# Altium project PCB_Project_1.PrjPcb
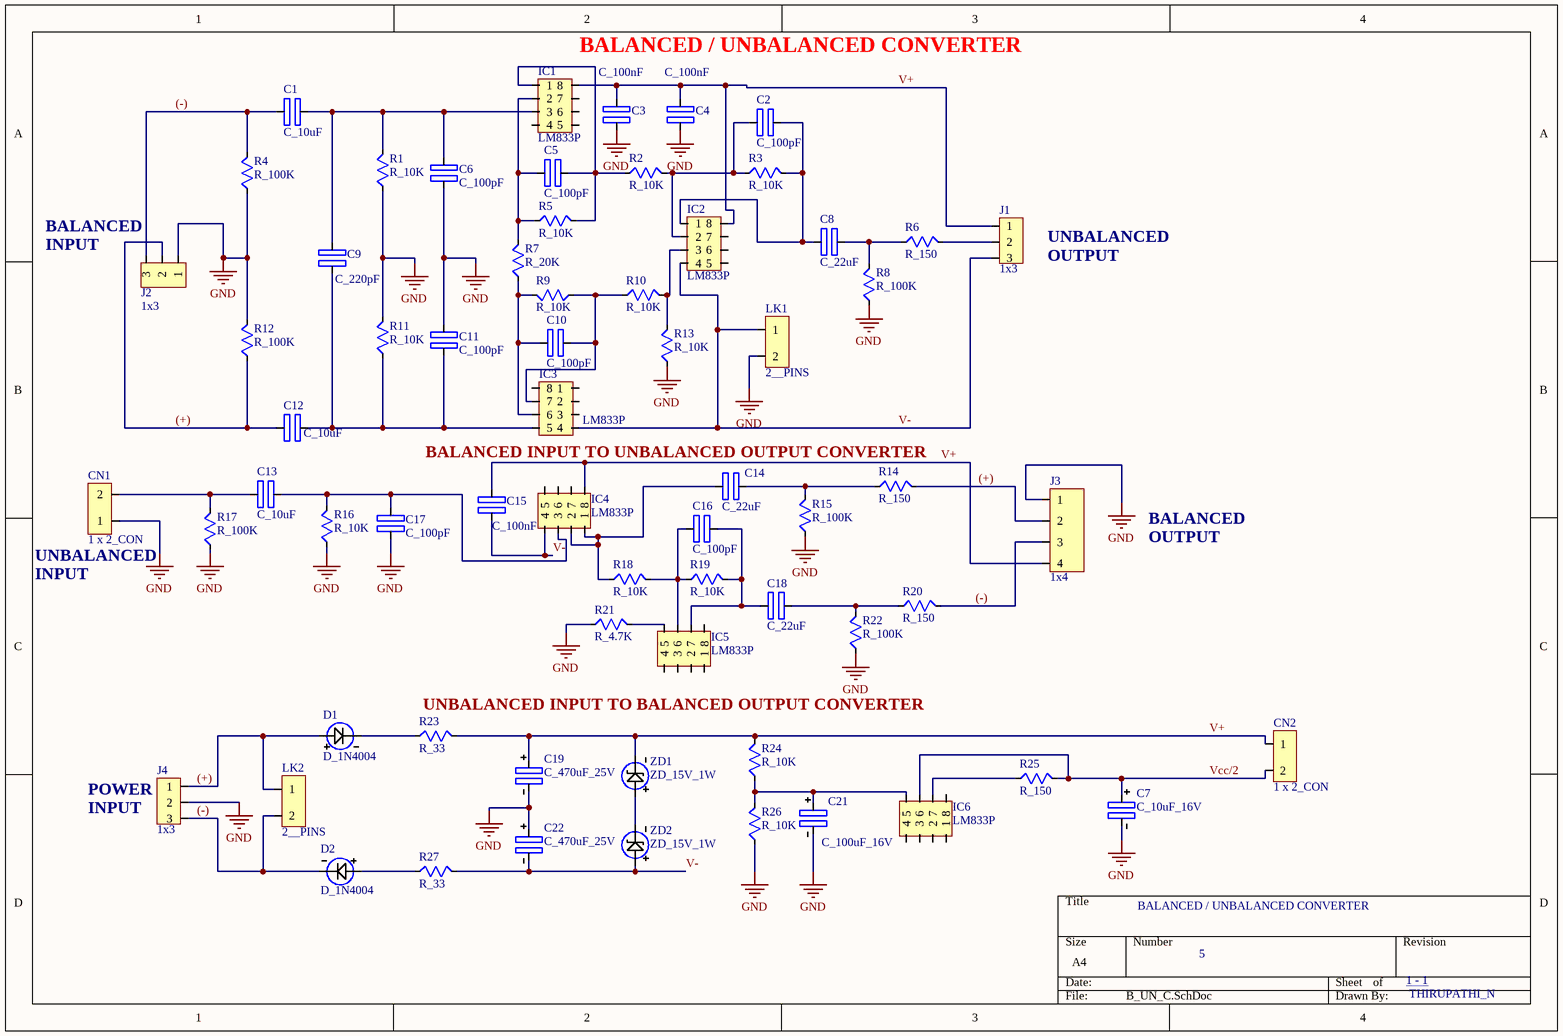
[diagram p0: B_UN_C.SchDoc]
1 sheet, 66 parts. Net scope: global (net labels, ports and power ports of the same name join across sheets).
Board file: B_UN_C.PcbDoc

## Sheet B_UN_C.SchDoc
size A4; SheetNumber: 1; SheetTotal: 1

### Parts
C1  C_10uF  [C_10uF]
C2  C_100pF  [C_100pF]
C3  C_100nF  [C_100nF]
C4  C_100nF  [C_100nF]
C5  C_100pF  [C_100pF]
C6  C_100pF  [C_100pF]
C7  C_10uF_16V  [C_10uF_16V]
C8  C_22uF  [C_22uF]
C9  C_220pF  [C_220pF]
C10  C_100pF  [C_100pF]
C11  C_100pF  [C_100pF]
C12  C_10uF  [C_10uF]
C13  C_10uF  [C_10uF]
C14  C_22uF  [C_22uF]
C15  C_100nF  [C_100nF]
C16  C_100pF  [C_100pF]
C17  C_100pF  [C_100pF]
C18  C_22uF  [C_22uF]
C19  C_470uF_25V  [C_25V_470uF]
C21  C_100uF_16V  [C_100uF_16V]
C22  C_470uF_25V  [C_25V_470uF]
CN1  1 x 2_CON  [1*2_CONNECTOR]
CN2  1 x 2_CON  [1*2_CONNECTOR]
D1  D_1N4004  [D_IN4004]
D2  D_1N4004  [D_IN4004]
IC1  LM833P  [IC_833]
IC2  LM833P  [IC_833]
IC3  LM833P  [IC_833]
IC4  LM833P  [IC_833]
IC5  LM833P  [IC_833]
IC6  LM833P  [IC_833]
J1  1x3  [1*3_CONNECTOR]
J2  1x3  [1*3_CONNECTOR]
J3  1x4  [1*4_CONNECTOR]
J4  1x3  [1*3_CONNECTOR]
LK1  2__PINS  [2_PIN]
LK2  2__PINS  [2_PIN]
R1  R_10K  [CF_RESISTOR_FP]
R2  R_10K  [CF_RESISTOR_FP]
R3  R_10K  [CF_RESISTOR_FP]
R4  R_100K  [CF_RESISTOR_FP]
R5  R_10K  [CF_RESISTOR_FP]
R6  R_150  [CF_RESISTOR_FP]
R7  R_20K  [CF_RESISTOR_FP]
R8  R_100K  [CF_RESISTOR_FP]
R9  R_10K  [CF_RESISTOR_FP]
R10  R_10K  [CF_RESISTOR_FP]
R11  R_10K  [CF_RESISTOR_FP]
R12  R_100K  [CF_RESISTOR_FP]
R13  R_10K  [CF_RESISTOR_FP]
R14  R_150  [CF_RESISTOR_FP]
R15  R_100K  [CF_RESISTOR_FP]
R16  R_10K  [CF_RESISTOR_FP]
R17  R_100K  [CF_RESISTOR_FP]
R18  R_10K  [CF_RESISTOR_FP]
R19  R_10K  [CF_RESISTOR_FP]
R20  R_150  [CF_RESISTOR_FP]
R21  R_4.7K  [R_4.7K]
R22  R_100K  [CF_RESISTOR_FP]
R23  R_33  [CF_RESISTOR_FP]
R24  R_10K  [CF_RESISTOR_FP]
R25  R_150  [CF_RESISTOR_FP]
R26  R_10K  [CF_RESISTOR_FP]
R27  R_33  [CF_RESISTOR_FP]
ZD1  ZD_15V_1W  [ZR_15V_1W]
ZD2  ZD_15V_1W  [ZR_15V_1W]

### Nets
GND: C3.0 C4.0 C6.0 C7.1 C11.1 C17.0 C19.1 C21.1 C22.0 CN1.1 J2.1 J3.1 J4.2 LK1.2 R1.0 R4.0 R8.0 R11.1 R12.1 R13.0 R15.0 R16.0 R17.0 R21.0 R22.0 R26.0
(+): C12.0 D1.2 J2.2 J3.2 J4.1 LK2.1 R12.0 R14.1
(-): C1.0 D2.1 J2.3 J3.3 J4.3 LK2.2 R4.1 R20.1
V+: C3.1 C4.1 C15.1 C19.0 CN2.1 IC1.8 IC2.8 IC4.8 J1.1 J3.4 R23.1 R24.1 ZD1.1
V-: C15.0 C22.1 IC2.4 IC3.4 IC4.4 J1.3 LK1.1 R27.1 ZD2.2
Vcc/2: C7.0 CN2.2 IC6.6 R25.1
NetC1_1: C1.1 C6.1 C9.1 IC1.3 R1.1
NetC2_0: C2.0 IC2.2 R2.1 R3.0
NetC2_1: C2.1 C8.0 IC2.1 R3.1
NetC5_0: C5.0 IC1.2 R5.0 R7.1
NetC5_1: C5.1 IC1.1 R2.0 R5.1
NetC8_1: C8.1 R6.0 R8.1
NetC9_0: C9.0 C11.0 C12.1 IC3.5 R11.0
NetC10_0: C10.0 IC3.7 R9.0 R10.0
NetC10_1: C10.1 IC3.6 R7.0 R9.1
NetC13_0: C13.0 CN1.2 R17.1
NetC13_1: C13.1 C17.1 IC4.3 R16.1
NetC14_0: C14.0 IC4.1 IC4.2 R18.0
NetC14_1: C14.1 R14.0 R15.1
NetC16_0: C16.0 IC5.6 R18.1 R19.0
NetC16_1: C16.1 C18.0 IC5.7 R19.1
NetC18_1: C18.1 R20.0 R22.1
NetC21_0: C21.0 IC6.5 R24.0 R26.1
NetD1_1: D1.1 R23.0
NetD2_2: D2.2 R27.0
NetIC2_3: IC2.3 R10.1 R13.1
NetIC5_5: IC5.5 R21.1
NetIC6_7: IC6.7 R25.0
NetJ1_2: J1.2 R6.1
NetZD1_2: ZD1.2 ZD2.1

Not connected (* = marked no-connect by the designer): IC1 4 5 6 7; IC2 5 6 7; IC3 1 2 3 8; IC4 5 6 7; IC5 1 2 3 4 8; IC6 1 2 3 4 8

### Notes on the sheet
- (near IC1) BALANCED / UNBALANCED CONVERTER
- (near J2) BALANCED
- (near J1) UNBALANCED
- INPUT
- (near J1) OUTPUT
- BALANCED INPUT TO UNBALANCED OUTPUT CONVERTER
- (near CN1) UNBALANCED
- BALANCED
- OUTPUT
- UNBALANCED INPUT TO BALANCED OUTPUT CONVERTER
- (near J4) POWER
- (near J4) INPUT
- BALANCED / UNBALANCED CONVERTER
- 5
- 1 - 1
- THIRUPATHI_N

### Library data of the parts
C1 C12 C13 = C_10uF: CAP ALUM 10UF 20% 400V RADIAL; Manufacturer: Nichicon; Manufacturer Part Number: UCA2G100MPD1TD; Life (Hours): 10000Hour; Ripple Current: 280mA; Lead Diameter: 0.6mm; Supplier 1: Digi-Key; RoHS: Yes; Category: Aluminum Electrolytic Capacitors; Stock 1: 4242; Pricing 1: 1=0.81000, 10=0.60000, 50=0.48020, 100=0.41150 (USD); Mount: Through Hole; Case/Package: Radial; Min Operating Temperature: -25°C; Max Operating Temperature: 105°C; Capacitance: 10uF; Voltage Rating: 400V; Tolerance: 20%; Packaging: Tape and Reel; Package Quantity: 500; Termination: Radial; Voltage Rating (DC): 400V; Series: CA; Lead Pitch: 0.197inch; Height - Seated (Max): 0.846inch; Lead Free: Lead Free; RoHS Compliant: Yes; ComponentLink1URL: https://datasheet.ciiva.com/6299/e-ca-6299384.pdf?src-supplier=Digi-Key; ComponentLink1Description: https://datasheet.ciiva.com/6299/e-ca-6299384.pdf?src-supplier=Digi-Key; Supplier Part Number 1: 493-4771-1-ND
C2 C5 C6 C10 C11 C16 C17 = C_100pF: CAPACITOR CERAMIC 100PF 3000V C0G 5%, RAD; Manufacturer: KEMET; Manufacturer Part Number: C330C101JHG5TA; Voltage Rating: 3kV; Temperature Coefficient: 30ppm/°C; Dissipation Factor: 0.1%; Lead/Base Style: Straight; Lead Diameter: 0.51mm; Pitch: 5.08mm; Lead Length: 7mm; Supplier 1: Digi-Key; RoHS: Yes; Category: Ceramic Capacitors; Stock 1: 2092; Pricing 1: 1=2.77000, 10=2.23700, 50=1.95200, 100=1.70800, 500=1.30134, 1000=1.13868, 2500=1.09801, 5000=1.05734 (USD); Mount: Through Hole; Case/Package: Radial; Number of Pins: 2; Min Operating Temperature: -55°C; Max Operating Temperature: 125°C; Capacitance: 100pF; Tolerance: 5%; Packaging: Bulk; Voltage Rating (DC): 3kV; Package Quantity: 250; Dielectric: C0G; Termination: Radial; Length: 7.62mm; Width: 7.62mm; Height: 3.81mm; Lead Pitch: 5.08mm; Height - Seated (Max): 0.36inch; Depth: 6.35mm; Radiation Hardening: No; REACH SVHC: No SVHC; Lead Free: Lead Free; RoHS Compliant: Yes; ComponentLink1URL: https://datasheet.ciiva.com/203/f3101-goldmax-203490.pdf?src-supplier=Digi-Key; ComponentLink1Description: https://datasheet.ciiva.com/203/f3101-goldmax-203490.pdf?src-supplier=Digi-Key; ComponentLink2URL: https://datasheet.ciiva.com/28645/706880-28645882.pdf?src-supplier=Element14; ComponentLink2Description: https://datasheet.ciiva.com/28645/706880-28645882.pdf?src-supplier=Element14; ComponentLink3URL: https://datasheet.ciiva.com/41659/f3101-goldmax-41659614.pdf?src-supplier=Farnell; ComponentLink3Description: https://datasheet.ciiva.com/41659/f3101-goldmax-41659614.pdf?src-supplier=Farnell; Supplier Part Number 1: 399-5096-ND
C3 C4 C15 = C_100nF: NICHICON   UVR2A0R1MDD1TD   ALUMINUM ELECTROLYTIC CAPACITOR, 0.1UF, 100V, 20%, RADIAL; Dielectric Material: Aluminium; Capacitance: 100nF; Ripple Current: 2.1mA; Life (Hours): 2000Hour; Supplier 1: Digi-Key; Manufacturer: Nichicon; Manufacturer Part Number: UVR2A0R1MDD1TD; RoHS: Yes; Category: Aluminum Electrolytic Capacitors; Stock 1: 5234; Pricing 1: 1=0.29000, 10=0.20000, 50=0.12000, 100=0.10140, 500=0.06936, 1000=0.06136 (USD); Mount: Through Hole; Case/Package: Radial; Number of Pins: 2; Min Operating Temperature: -40°C; Max Operating Temperature: 85°C; Package Quantity: 1; Packaging: Tape and Reel; Tolerance: 20%; Voltage Rating: 100V; Termination: Radial; Voltage Rating (DC): 100V; Series: VR; Diameter: 5mm; Height: 11mm; Lead Pitch: 0.079inch; Height - Seated (Max): 0.492inch; REACH SVHC: No SVHC; RoHS Compliant: Yes; ComponentLink1URL: https://datasheet.ciiva.com/7907/e-vr-7907512.pdf?src-supplier=Element14; ComponentLink1Description: https://datasheet.ciiva.com/7907/e-vr-7907512.pdf?src-supplier=Element14; ComponentLink2URL: https://datasheet.ciiva.com/29544/e-vr-29544649.pdf?src-supplier=Digi-Key; ComponentLink2Description: https://datasheet.ciiva.com/29544/e-vr-29544649.pdf?src-supplier=Digi-Key; Supplier Part Number 1: 493-12812-1-ND
C7 = C_10uF_16V: CAPACITOR ALUM ELECT, 10UF, 16V, 20%, RADIAL; Manufacturer: Nichicon; Manufacturer Part Number: UST1C100MDD1TE; Ripple Current: 29mA; Leakage Current: 3uA; Life (Hours): 1000Hour; Dissipation Factor: 0.18%; Supplier 1: Digi-Key; RoHS: Yes; Category: Aluminum Electrolytic Capacitors; Stock 1: 4188; Pricing 1: 1=0.25000, 10=0.17300, 50=0.11540, 100=0.09810, 500=0.06928, 1000=0.06062 (USD); Mount: Through Hole; Case/Package: Radial; Min Operating Temperature: -55°C; Max Operating Temperature: 105°C; Package Quantity: 1; Capacitance: 10uF; Voltage Rating: 16V; Tolerance: 20%; Packaging: Tape and Reel; Termination: Radial; Voltage Rating (DC): 16V; Series: PML CAP, ST; Diameter: 4mm; Length: 7mm; Height: 7mm; Lead Pitch: 0.059inch; Height - Seated (Max): 0.315inch; RoHS Compliant: Yes; ComponentLink1URL: https://datasheet.ciiva.com/6314/e-st-6314645.pdf?src-supplier=Digi-Key; ComponentLink1Description: https://datasheet.ciiva.com/6314/e-st-6314645.pdf?src-supplier=Digi-Key; Supplier Part Number 1: 493-14735-1-ND
C8 C14 C18 = C_22uF: Cap Aluminum Lytic 22uF 50V 20% (5 X 11mm) Radial 2.5mm 95mA 2000h 85C Ammo Pack; Manufacturer: Nichicon; Manufacturer Part Number: UVR1H220MDD1TD; Dielectric Material: Aluminium; Leakage Current: 33uA; Life (Hours): 2000Hour; Dissipation Factor: 0.12%; Lead Diameter: 0.5mm; Supplier 1: Digi-Key; RoHS: Yes; Category: Aluminum Electrolytic Capacitors; Stock 1: 2541; Pricing 1: 1=0.29000, 10=0.20000, 50=0.12000, 100=0.10140, 500=0.06936, 1000=0.06136 (USD); Mount: Through Hole,PCB; Case/Package: Radial; Contact Plating: Tin,Matte; Min Operating Temperature: -40°C; Max Operating Temperature: 85°C; Capacitance: 22uF; Voltage Rating: 50V; Tolerance: 20%; Ripple Current: 95mA; Packaging: Tape and Reel; Package Quantity: 1; Voltage Rating (DC): 50V; Termination: Radial; Voltage: 50V; Features: General Purpose; Series: VR; Construction: RADIAL; Diameter: 5mm; Length: 11mm; Height: 11mm; Height - Seated (Max): 0.492inch; Lead Pitch: 2mm; Radiation Hardening: No; REACH SVHC: No SVHC; Lead Free: Lead Free; RoHS Compliant: Yes; ComponentLink1URL: https://datasheet.ciiva.com/16512/e-vr-16512886.pdf?src-supplier=Future+Electronics; ComponentLink1Description: https://datasheet.ciiva.com/16512/e-vr-16512886.pdf?src-supplier=Future+Electronics; ComponentLink2URL: https://datasheet.ciiva.com/5330/e-vr-6088-5330936.pdf?src-supplier=Mouser; ComponentLink2Description: https://datasheet.ciiva.com/5330/e-vr-6088-5330936.pdf?src-supplier=Mouser; ComponentLink3URL: https://datasheet.ciiva.com/7781/e-vr-7781742.pdf?src-supplier=Element14; ComponentLink3Description: https://datasheet.ciiva.com/7781/e-vr-7781742.pdf?src-supplier=Element14; ComponentLink4URL: https://datasheet.ciiva.com/6298/e-vr-6298255.pdf?src-supplier=Digi-Key; ComponentLink4Description: https://datasheet.ciiva.com/6298/e-vr-6298255.pdf?src-supplier=Digi-Key; Supplier Part Number 1: 493-6098-1-ND
C9 = C_220pF: VISHAY         F221K25Y5RN6UK5R             Ceramic Disc & Plate Capacitor, 220 pF, 1 kV, F Series,  10%, Radial Leaded, Y5R; Manufacturer: Vishay BCcomponents; Capacitance: 220pF; Voltage Rating: 1kV; Insulation Resistance: 10GR; Lead/Base Style: Kinked; Lead Diameter: 0.6mm; Supplier 1: Digi-Key; Manufacturer Part Number: F221K25Y5RN6UK5R; RoHS: Yes; Category: Ceramic Capacitors; Stock 1: 17892; Pricing 1: 1=0.26000, 10=0.18000, 50=0.11960, 100=0.10170, 500=0.07180, 1000=0.06283 (USD); Mount: Through Hole; Case/Package: Radial; Dielectric Material: Ceramic; Min Operating Temperature: -30°C; Max Operating Temperature: 125°C; Tolerance: 10%; Dielectric: Y5R; Termination: Radial; Package Quantity: 2000; Packaging: Tape and Reel; Resistor Type: Ceramic; Voltage: 1kV; Series: F; Construction: RADIAL; Length: 6.5mm; Lead Pitch: 5mm; Depth: 4.5mm; Radiation Hardening: No; REACH SVHC: Unknown; RoHS Compliant: Yes; ComponentLink1URL: https://datasheet.ciiva.com/11789/0900766b80d81bfa-11789705.pdf?src-supplier=RSComponents; ComponentLink1Description: https://datasheet.ciiva.com/11789/0900766b80d81bfa-11789705.pdf?src-supplier=RSComponents; ComponentLink2URL: https://datasheet.ciiva.com/15165/getdatasheetpartid-691058-15165003.pdf?src-supplier=Verical; ComponentLink2Description: https://datasheet.ciiva.com/15165/getdatasheetpartid-691058-15165003.pdf?src-supplier=Verical; ComponentLink3URL: https://datasheet.ciiva.com/182/hvldf02-182150.pdf?src-supplier=Digi-Key; ComponentLink3Description: https://datasheet.ciiva.com/182/hvldf02-182150.pdf?src-supplier=Digi-Key; ComponentLink4URL: https://datasheet.ciiva.com/11461/hvldf02-11461596.pdf?src-supplier=Avnet; ComponentLink4Description: https://datasheet.ciiva.com/11461/hvldf02-11461596.pdf?src-supplier=Avnet; ComponentLink5URL: https://datasheet.ciiva.com/16695/hvldf02-16695021.pdf?src-supplier=Avnet+Europe; ComponentLink5Description: https://datasheet.ciiva.com/16695/hvldf02-16695021.pdf?src-supplier=Avnet+Europe; ComponentLink6URL: https://datasheet.ciiva.com/7974/1522849-7974607.pdf?src-supplier=Element14; ComponentLink6Description: https://datasheet.ciiva.com/7974/1522849-7974607.pdf?src-supplier=Element14; Supplier Part Number 1: BC5218CT-ND
C19 C22 = C_470uF_25V: NICHICON         UHE1E471MPD6TD            ALUMINUM ELECTROLYTIC CAPACITOR, 470UF, 25V, 20%, RADIAL; Dielectric Material: Aluminium; Ripple Current: 1.21A; ESR (Equivalent Series Resistance): 240mR; Polarity: Polar; Impedance: 60mR; Life (Hours): 7000Hour; Dissipation Factor: 0.14%; Lead Diameter: 0.6mm; Supplier 1: Digi-Key; Manufacturer: Nichicon; Manufacturer Part Number: UHE1E471MPD6TD; RoHS: Yes; Category: Aluminum Electrolytic Capacitors; Stock 1: 3720; Pricing 1: 1=0.70000, 10=0.49200, 50=0.37180, 100=0.32390 (USD); Mount: Through Hole; Case/Package: Radial; Number of Pins: 2; Min Operating Temperature: -40°C; Max Operating Temperature: 105°C; Capacitance: 470uF; Tolerance: 20%; Packaging: Tape and Reel; Package Quantity: 500; Voltage Rating: 25V; Voltage Rating (DC): 25V; Termination: Radial; Series: HE; Diameter: 10mm; Length: 16mm; Height: 16mm; Lead Pitch: 5mm; Height - Seated (Max): 0.688inch; Radiation Hardening: No; REACH SVHC: No SVHC; Lead Free: Lead Free; RoHS Compliant: Yes; ComponentLink1URL: https://datasheet.ciiva.com/17520/e-he-17520934.pdf?src-supplier=Avnet+Europe; ComponentLink1Description: https://datasheet.ciiva.com/17520/e-he-17520934.pdf?src-supplier=Avnet+Europe; ComponentLink2URL: https://datasheet.ciiva.com/7851/e-he-7851630.pdf?src-supplier=Element14; ComponentLink2Description: https://datasheet.ciiva.com/7851/e-he-7851630.pdf?src-supplier=Element14; Supplier Part Number 1: 493-15240-1-ND
C21 = C_100uF_16V: Cap Aluminum Lytic 100uF 16V 20% (6.3 X 7mm) Radial 2.5mm 110mA 1000h 105°C Ammo; Manufacturer: KEMET; Manufacturer Part Number: ESS107M016AE2EA; Supplier 1: Digi-Key; Category: Aluminum Electrolytic Capacitors; Stock 1: 4956; Pricing 1: 1=0.22000, 10=0.14800, 50=0.08920, 100=0.07520, 500=0.05148, 1000=0.04554 (USD); Case/Package: Aluminum; Max Operating Temperature: 105°C; Capacitance: 100uF; Package Quantity: 2000; Voltage Rating: 16V; Voltage Rating (DC): 16V; Tolerance: 20%; Packaging: Ammo Pack; Termination: Radial; Series: ESS; Length: 7mm; Lead Pitch: 5mm; RoHS Compliant: Yes; ComponentLink1URL: http://www.mouser.com/ds/2/212/KEM_A4057_ESS-1077971.pdf?src-supplier=Mouser; ComponentLink1Description: http://www.mouser.com/ds/2/212/KEM_A4057_ESS-1077971.pdf?src-supplier=Mouser; ComponentLink2URL: http://datasheet.octopart.com/ESS107M016AE2EA-KEMET-datasheet-141704041.pdf?src-supplier=Farnell; ComponentLink2Description: http://datasheet.octopart.com/ESS107M016AE2EA-KEMET-datasheet-141704041.pdf?src-supplier=Farnell; ComponentLink3URL: http://datasheet.octopart.com/ESS107M016AE2EA-KEMET-datasheet-102161911.pdf?src-supplier=Newark; ComponentLink3Description: http://datasheet.octopart.com/ESS107M016AE2EA-KEMET-datasheet-102161911.pdf?src-supplier=Newark; Supplier Part Number 1: 399-18280-1-ND
CN1 CN2 = 1 x 2_CON: TERM BLK 2POS SIDE ENTRY 5MM PCB; Manufacturer: Wurth Electronics; Manufacturer Part Number: 691137710002; Plating: Copper Alloy; Number of Levels: 1; Number of Positions Per Level: 2; Current: 16A; Voltage: 300V; Wire Gauge (Max): 30AWG; Wire Gauge (Min): 12AWG; Supplier 1: Digi-Key; RoHS: No; Category: Terminal Blocks; Stock 1: 8076; Pricing 1: 1=0.38000, 10=0.34000, 50=0.30000, 100=0.27000, 500=0.26000 (USD); Mount: Through Hole; Color: Green; Housing Material: PC; Min Operating Temperature: -30°C; Max Operating Temperature: 120°C; Packaging: Bulk; Termination: Screw; ComponentLink1URL: https://katalog.we-online.de/em/datasheet/691137710002.pdf?src-supplier=Digi-Key; ComponentLink1Description: https://katalog.we-online.de/em/datasheet/691137710002.pdf?src-supplier=Digi-Key; Supplier Part Number 1: 732-10955-ND
D1 D2 = D_1N4004: DIODES INC. - 1N4004-T - Standard Recovery Diode, 400 V, 1 A, Single, 1 V, 30 A; Max Surge Current: 30A; Max Reverse Current: 5uA; Forward Current: 1A; Forward Voltage: 1V; Reverse Voltage (DC): 400V; Recovery Time: 2us; Capacitance: 15pF; Supplier 1: Digi-Key; Manufacturer: Diodes; Manufacturer Part Number: 1N4004-T; RoHS: Yes; Category: Rectifier Diodes; Stock 1: 261573; Pricing 1: 1=0.21000, 10=0.18800, 100=0.10220, 500=0.06292, 1000=0.04290, 2000=0.03647 (USD); Case/Package: DO-41; Number of Pins: 2; Weight: 0.010582oz; Contact Plating: Tin; Min Operating Temperature: -65°C; Max Operating Temperature: 150°C; Package Quantity: 5000; Packaging: Tape and Reel; Average Rectified Current: 1A; Max Repetitive Reverse Voltage (Vrrm): 400V; Peak Non-Repetitive Surge Current: 30A; Max Forward Surge Current (Ifsm): 30A; Termination: Through Hole; Polarity: Standard; Voltage Rating (DC): 400V; Current Rating: 1A; Output Current: 1A; Max Reverse Voltage (DC): 400V; Series: -; Diameter: 5.21mm; Length: 4.7mm; Width: 2.71mm; Height: 2.71mm; Radiation Hardening: No; REACH SVHC: No SVHC; Lead Free: Lead Free; RoHS Compliant: Yes; ComponentLink1URL: https://datasheet.ciiva.com/1176/ds28002-1176810.pdf?src-supplier=Element14; ComponentLink1Description: https://datasheet.ciiva.com/1176/ds28002-1176810.pdf?src-supplier=Element14; ComponentLink2URL: https://datasheet.ciiva.com/15219/getdatasheetpartid-115928-15219542.pdf?src-supplier=Verical; ComponentLink2Description: https://datasheet.ciiva.com/15219/getdatasheetpartid-115928-15219542.pdf?src-supplier=Verical; ComponentLink3URL: https://datasheet.ciiva.com/25947/ds28002-25947016.pdf?src-supplier=Avnet+Europe; ComponentLink3Description: https://datasheet.ciiva.com/25947/ds28002-25947016.pdf?src-supplier=Avnet+Europe; ComponentLink4URL: https://datasheet.ciiva.com/3304/ds28002-3304198.pdf?src-supplier=Avnet; ComponentLink4Description: https://datasheet.ciiva.com/3304/ds28002-3304198.pdf?src-supplier=Avnet; Supplier Part Number 1: 1N4004DICT-ND
IC1-IC6 = LM833P: OP Amp Dual GP 18V/36V 8-Pin PDIP Tube; Manufacturer: Texas Instruments; Min Supply Voltage: 10V; Max Supply Voltage: 36V; Min Dual Supply Voltage: 5V; Max Dual Supply Voltage: 18V; Voltage Gain: 110dB; Unity Gain Bandwidth Product: 16MHz; Slew Rate: 7V/µs; Common Mode Rejection Ratio: 80dB; Nominal Supply Current: 2.05mA; Input Offset Voltage (Vos): 150uV; Number of Circuits: 2; Input Bias Current: 300nA; Output Current per Channel: 37mA; Max Power Dissipation: 500mW; Supplier 1: Digi-Key; Manufacturer Part Number: LM833P; RoHS: Yes; Category: Amplifiers - Op Amps, Buffer, Instrumentation; Stock 1: 1823; Pricing 1: 1=4.95000, 10=4.44500, 25=4.20240, 100=3.64210, 250=3.45528, 500=3.10042, 1000=2.94254 (USD); Mount: Through Hole; Case/Package: PDIP; Number of Pins: 8; Contact Plating: Gold; Min Operating Temperature: -40°C; Max Operating Temperature: 85°C; Packaging: Rail/Tube; Bandwidth: 16MHz; Package Quantity: 50; Operating Supply Voltage: 18V; Gain Bandwidth Product: 16MHz; Operating Supply Current: 2.05mA; Number of Amplifiers: 2; Number of Elements: 2; Number of Channels: 2; Power Supply Rejection Ratio (PSRR): 80dB; Length: 10.16mm; Width: 6.6mm; Height: 4.57mm; Radiation Hardening: No; REACH SVHC: No SVHC; Lead Free: Lead Free; RoHS Compliant: Yes; ComponentLink1URL: https://datasheet.ciiva.com/14151/lm833-eng-ds-14151125.pdf?src-supplier=Distrelec; ComponentLink1Description: https://datasheet.ciiva.com/14151/lm833-eng-ds-14151125.pdf?src-supplier=Distrelec; ComponentLink2URL: https://datasheet.ciiva.com/7738/1863608-7738599.pdf?src-supplier=Element14; ComponentLink2Description: https://datasheet.ciiva.com/7738/1863608-7738599.pdf?src-supplier=Element14; Supplier Part Number 1: 296-27907-5-ND
J1 J2 J4 = 1x3: Fixed Terminal Blocks WR-TBL SMT Model7097 3Pin 5mm Hztl; Manufacturer: Wurth Electronics Midcom; Manufacturer Part Number: 691709710303; Plating: Steel; Voltage Rating: 300V; Current Rating: 6A; Number of Levels: 1; Number of Positions Per Level: 3; Connector Type: Screw; Wire/Cable Gauge: 30AWG; Wire Gauge (Min): 14AWG; Pitch: 0.197inch; Supplier 1: Digi-Key; RoHS: Yes; Category: Terminal Blocks; Stock 1: 370; Pricing 1: 1=3.63000, 10=3.41600, 50=3.13600, 100=2.85600 (USD); Mount: Surface Mount; Color: Black; Contact Plating: Tin; Housing Material: Nylon; Min Operating Temperature: -40°C; Max Operating Temperature: 115°C; Package Quantity: 200; Packaging: Tape and Reel; Current: 6A; Voltage: 300V; Termination: Screw; Number of Positions: 3; Number of Contacts: 3; Wire Gauge (Max): 30AWG; REACH SVHC: Unknown; Flammability Rating: UL94 V-0; ComponentLink1URL: https://datasheet.ciiva.com/29677/6917097103xx-29677797.pdf?src-supplier=Digi-Key; ComponentLink1Description: https://datasheet.ciiva.com/29677/6917097103xx-29677797.pdf?src-supplier=Digi-Key; ComponentLink2URL: https://datasheet.ciiva.com/29677/6917097103xx-29677798.pdf?src-supplier=Digi-Key; ComponentLink2Description: https://datasheet.ciiva.com/29677/6917097103xx-29677798.pdf?src-supplier=Digi-Key; ComponentLink3URL: https://datasheet.ciiva.com/29677/6917097103xx-29677799.pdf?src-supplier=Digi-Key; ComponentLink3Description: https://datasheet.ciiva.com/29677/6917097103xx-29677799.pdf?src-supplier=Digi-Key; Supplier Part Number 1: 1297-1109-1-ND
J3 = 1x4: TERM BLK 4POS SIDE ENTRY 5MM PCB; Manufacturer: Wurth Electronics; Manufacturer Part Number: 691137710004; Plating: Copper Alloy; Number of Levels: 1; Number of Positions Per Level: 4; Current: 16A; Voltage: 300V; Wire Gauge (Max): 30AWG; Wire Gauge (Min): 12AWG; Supplier 1: Digi-Key; RoHS: No; Category: Terminal Blocks; Stock 1: 1602; Pricing 1: 1=0.72000, 10=0.63000, 50=0.57000, 100=0.51000, 500=0.48000 (USD); Mount: Through Hole; Color: Green; Housing Material: PC; Min Operating Temperature: -30°C; Max Operating Temperature: 120°C; Packaging: Bulk; Termination: Screw; ComponentLink1URL: https://katalog.we-online.de/em/datasheet/691137710004.pdf?src-supplier=Digi-Key; ComponentLink1Description: https://katalog.we-online.de/em/datasheet/691137710004.pdf?src-supplier=Digi-Key; Supplier Part Number 1: 732-10957-ND
LK1 LK2 = 2__PINS: HARWIN - M20-9990246 - CONNECTOR, HEADER, 2 POSITION, 1ROW, 2.54MM; Contact Resistance: 30mR; Max Current Rating: 3A; Number of Positions: 2; Gender: Male; Connector Type: Male Pin; Insulation Resistance: 10GR; Voltage Rating (AC): 750V; Supplier 1: Digi-Key; Manufacturer: Harwin; Manufacturer Part Number: M20-9990246; RoHS: Yes; Category: Headers and Wire Housings; Stock 1: 149358; Pricing 1: 1=0.11000, 10=0.10400, 100=0.06440, 500=0.05332, 1000=0.04666, 5000=0.04000, 10000=0.03889 (USD); Mount: Through Hole; Case/Package: SIL; Color: Black; Housing Color: Black; Housing Material: Nylon; Contact Plating: Tin; Contact Material: Brass,Bronze; Min Operating Temperature: -40°C; Max Operating Temperature: 105°C; Package Quantity: 1000; Packaging: Bulk; Termination: Solder; Number of Rows: 1; Number of Contacts: 2; Orientation: Straight; Current Rating: 3A; Length: 5.08mm; Depth: 2.54mm; Pitch: 2.54mm; Contact Mating Length: 0.24inch; Radiation Hardening: No; REACH SVHC: No SVHC; ComponentLink1URL: https://datasheet.ciiva.com/8046/315376-8046930.pdf?src-supplier=Element14; ComponentLink1Description: https://datasheet.ciiva.com/8046/315376-8046930.pdf?src-supplier=Element14; ComponentLink2URL: https://datasheet.ciiva.com/11745/0900766b81034e61-11745755.pdf?src-supplier=RSComponents; ComponentLink2Description: https://datasheet.ciiva.com/11745/0900766b81034e61-11745755.pdf?src-supplier=RSComponents; ComponentLink3URL: https://datasheet.ciiva.com/22660/1830818-22660571.pdf?src-supplier=Element14; ComponentLink3Description: https://datasheet.ciiva.com/22660/1830818-22660571.pdf?src-supplier=Element14; ComponentLink4URL: https://datasheet.ciiva.com/6833/m20-999-6833368.pdf?src-supplier=Digi-Key; ComponentLink4Description: https://datasheet.ciiva.com/6833/m20-999-6833368.pdf?src-supplier=Digi-Key; ComponentLink5URL: https://datasheet.ciiva.com/26852/getdatasheetpartid-384170-26852203.pdf?src-supplier=Verical; ComponentLink5Description: https://datasheet.ciiva.com/26852/getdatasheetpartid-384170-26852203.pdf?src-supplier=Verical; Supplier Part Number 1: 952-2262-ND
R1-R3 R5 R9-R11 R13 R16 R18 R19 R24 R26 = R_10K: RES 10K OHM 1/4W 5% AXIAL; Manufacturer: Stackpole Electronics; Manufacturer Part Number: CF14JT10K0; Resistance: 10kR; Power Rating: 250mW; Temperature Coefficient: -500ppm/°C; Supplier 1: Digi-Key; RoHS: Yes; Category: Through-Hole Resistors; Stock 1: 1267420; Pricing 1: 1=0.10000, 10=0.03600, 25=0.02640, 50=0.02000, 100=0.01480, 250=0.01124, 500=0.00900, 1000=0.00662 (USD); Mount: Through Hole,Axial; Case/Package: Conformal; Contact Plating: Tin,Matte; Min Operating Temperature: -55°C; Max Operating Temperature: 155°C; Packaging: Tape and Reel; Tolerance: 5%; Package Quantity: 1; Resistor Type: Carbon Film; Number of Terminations: 2; Termination: Axial; Max Power Dissipation: 250mW; Features: Flame Retardant Coating; Series: CF; Construction: Cylindrical; Diameter: 2.3mm; Length: 6.5mm; Radiation Hardening: No; Military Standard: Not; Lead Free: Lead Free; RoHS Compliant: Yes; ComponentLink1URL: http://components.arrow.com/part/dataview/27619991S9848636N1174?src-supplier=Arrow+Electronics; ComponentLink1Description: http://components.arrow.com/part/dataview/27619991S9848636N1174?src-supplier=Arrow+Electronics; ComponentLink2URL: https://www.verical.com/server-webapp/html/getDatasheet?partID=367360&src-supplier=Verical; ComponentLink2Description: https://www.verical.com/server-webapp/html/getDatasheet?partID=367360&src-supplier=Verical; ComponentLink3URL: https://www.seielect.com/catalog/SEI-CF_CFM.pdf?src-supplier=Avnet; ComponentLink3Description: https://www.seielect.com/catalog/SEI-CF_CFM.pdf?src-supplier=Avnet; ComponentLink4URL: http://www.seielect.com/Catalog/SEI-CF_CFM.pdf?src-supplier=Future+Electronics; ComponentLink4Description: http://www.seielect.com/Catalog/SEI-CF_CFM.pdf?src-supplier=Future+Electronics; ComponentLink5URL: https://www.seielect.com/catalog/SEI-Packaging.pdf?src-supplier=Digi-Key; ComponentLink5Description: https://www.seielect.com/catalog/SEI-Packaging.pdf?src-supplier=Digi-Key; Supplier Part Number 1: CF14JT10K0CT-ND
R4 R8 R12 R15 R17 R22 = R_100K: RES 100K OHM 1/4W 5% AXIAL; Manufacturer: Stackpole Electronics; Manufacturer Part Number: CF14JT100K; Resistance: 100kR; Power Rating: 250mW; Temperature Coefficient: -850ppm/°C; Supplier 1: Digi-Key; RoHS: Yes; Category: Through-Hole Resistors; Stock 1: 666123; Pricing 1: 1=0.10000, 10=0.03600, 25=0.02640, 50=0.02000, 100=0.01480, 250=0.01124, 500=0.00900, 1000=0.00662 (USD); Mount: Through Hole,Axial; Case/Package: Conformal; Contact Plating: Tin,Matte; Min Operating Temperature: -55°C; Max Operating Temperature: 155°C; Packaging: Tape and Reel; Tolerance: 5%; Package Quantity: 1; Resistor Type: Carbon Film; Number of Terminations: 2; Termination: Axial; Max Power Dissipation: 250mW; Features: Flame Retardant Coating; Series: CF; Construction: Cylindrical; Diameter: 2.3mm; Length: 6.5mm; Radiation Hardening: No; Military Standard: Not; Lead Free: Lead Free; RoHS Compliant: Yes; ComponentLink1URL: https://datasheet.ciiva.com/26835/getdatasheetpartid-362215-26835399.pdf?src-supplier=Verical; ComponentLink1Description: https://datasheet.ciiva.com/26835/getdatasheetpartid-362215-26835399.pdf?src-supplier=Verical; Supplier Part Number 1: CF14JT100KCT-ND
R6 R14 R20 R25 = R_150: Res Carbon Film 150 Ohm 5% 1/4W -400ppm/C to 0ppm/C Conformal AXL Thru-Hole T/R; Manufacturer: Stackpole Electronics; Manufacturer Part Number: CF14JT150R; Resistance: 150R; Power Rating: 250mW; Temperature Coefficient: -400ppm/°C; Supplier 1: Digi-Key; RoHS: Yes; Category: Through-Hole Resistors; Stock 1: 90352; Pricing 1: 1=0.10000, 10=0.03600, 25=0.02640, 50=0.02000, 100=0.01480, 250=0.01124, 500=0.00900, 1000=0.00662 (USD); Mount: Through Hole,Axial; Case/Package: Conformal; Contact Plating: Tin,Matte; Min Operating Temperature: -55°C; Max Operating Temperature: 155°C; Package Quantity: 5000; Tolerance: 5%; Packaging: Tape and Reel; Resistor Type: Carbon Film; Number of Terminations: 2; Termination: Axial; Max Power Dissipation: 250mW; Features: Flame Retardant Coating; Series: CF; Construction: Cylindrical; Diameter: 2.3mm; Length: 6.5mm; Radiation Hardening: No; Military Standard: Not; Lead Free: Lead Free; RoHS Compliant: Yes; ComponentLink1URL: http://www1.futureelectronics.com/doc/STACKPOLE%20ELECTRONICS/CF-1__4-150R-5%25-R.pdf?src-supplier=Future+Electronics; ComponentLink1Description: http://www1.futureelectronics.com/doc/STACKPOLE%20ELECTRONICS/CF-1__4-150R-5%25-R.pdf?src-supplier=Future+Electronics; ComponentLink2URL: https://www.seielect.com/Catalog/SEI-CF_CFM.pdf?src-supplier=Digi-Key; ComponentLink2Description: https://www.seielect.com/Catalog/SEI-CF_CFM.pdf?src-supplier=Digi-Key; ComponentLink3URL: https://www.seielect.com/catalog/SEI-Packaging.pdf?src-supplier=Digi-Key; ComponentLink3Description: https://www.seielect.com/catalog/SEI-Packaging.pdf?src-supplier=Digi-Key; ComponentLink4URL: https://www.verical.com/server-webapp/html/getDatasheet?partID=360907&src-supplier=Verical; ComponentLink4Description: https://www.verical.com/server-webapp/html/getDatasheet?partID=360907&src-supplier=Verical; ComponentLink5URL: https://www.seielect.com/catalog/SEI-CF_CFM.pdf?src-supplier=Avnet; ComponentLink5Description: https://www.seielect.com/catalog/SEI-CF_CFM.pdf?src-supplier=Avnet; ComponentLink6URL: https://www.seielect.com/catalog/SEI-CF_CFM.pdf?src-supplier=Avnet+Asia; ComponentLink6Description: https://www.seielect.com/catalog/SEI-CF_CFM.pdf?src-supplier=Avnet+Asia; ComponentLink7URL: http://components.arrow.com/part/dataview/44988609S3426981N1174?src-supplier=Arrow+Electronics; ComponentLink7Description: http://components.arrow.com/part/dataview/44988609S3426981N1174?src-supplier=Arrow+Electronics; Supplier Part Number 1: CF14JT150RCT-ND
R7 = R_20K: RES 20K OHM 1/2W 5% AXIAL; Manufacturer: Stackpole Electronics; Manufacturer Part Number: CF12JT20K0; Max Power Dissipation: 500mW; Temperature Coefficient: -500ppm/°C; Resistance: 20kR; Supplier 1: Digi-Key; RoHS: Yes; Category: Through-Hole Resistors; Stock 1: 24212; Pricing 1: 1=0.10000, 10=0.06500, 25=0.04720, 50=0.03600, 100=0.02660, 250=0.02024, 500=0.01620, 1000=0.01192 (USD); Mount: Through Hole,Axial; Case/Package: Axial; Contact Plating: Tin,Matte; Min Operating Temperature: -55°C; Max Operating Temperature: 155°C; Resistor Type: Carbon Film; Number of Terminations: 2; Features: Flame Retardant Coating; Tolerance: 5%; Package Quantity: 1; Packaging: Tape and Reel; Diameter: 2.7mm; Length: 0.335inch; Radiation Hardening: No; Lead Free: Lead Free; ComponentLink1URL: http://components.arrow.com/part/dataview/2806914S4483198N1174?src-supplier=Arrow+Electronics; ComponentLink1Description: http://components.arrow.com/part/dataview/2806914S4483198N1174?src-supplier=Arrow+Electronics; ComponentLink2URL: https://www.seielect.com/Catalog/SEI-CF_CFM.pdf?src-supplier=Digi-Key; ComponentLink2Description: https://www.seielect.com/Catalog/SEI-CF_CFM.pdf?src-supplier=Digi-Key; ComponentLink3URL: https://www.seielect.com/catalog/SEI-CF_CFM.pdf?src-supplier=Avnet; ComponentLink3Description: https://www.seielect.com/catalog/SEI-CF_CFM.pdf?src-supplier=Avnet; Supplier Part Number 1: CF12JT20K0CT-ND
R21 = R_4.7K: RESISTOR, CERAMIC, 4.7KOHM, 2W, 10%; Product Range:OY Series; Resistance:4.7kohm; Power Rating:2W; Resistance Tolerance: 10%; Voltage Rating:400V; Resistor Case Style:Axial Leaded; Resistor Element Type:Ceramic ;RoHS Compliant: Yes; Manufacturer: Ohmite; Manufacturer Part Number: OY472KE; Voltage Rating: 400V; Resistance: 4.7kR; Temperature Coefficient: 300ppm/°C; Lead Diameter: 0.8mm; Lead Length: 38mm; Wire/Cable Diameter: 0.031inch; Supplier 1: Digi-Key; RoHS: Yes; Category: Through-Hole Resistors; Stock 1: 1750; Pricing 1: 1=2.23000, 10=1.98000, 25=1.83600, 50=1.72800, 100=1.51200, 250=1.29600, 500=1.08000, 1000=0.95760 (USD); Mount: Through Hole; Case/Package: Axial; Material: Ceramic; Min Operating Temperature: -40°C; Max Operating Temperature: 220°C; Voltage Rating (DC): 400V; Power Rating: 2W; Tolerance: 10%; Package Quantity: 50; Packaging: Bulk; Resistor Type: Ceramic; Termination: Axial; Number of Terminations: 2; Max Power Dissipation: 2W; Features: Moisture Resistant; Series: OY; Diameter: 7mm; Length: 0.748inch; REACH SVHC: Unknown; Lead Free: Lead Free; RoHS Compliant: Yes; ComponentLink1URL: https://datasheet.ciiva.com/7715/95960-7715573.pdf?src-supplier=Element14; ComponentLink1Description: https://datasheet.ciiva.com/7715/95960-7715573.pdf?src-supplier=Element14; ComponentLink2URL: https://datasheet.ciiva.com/2716/res-ox-oy-2716365.pdf?src-supplier=Digi-Key; ComponentLink2Description: https://datasheet.ciiva.com/2716/res-ox-oy-2716365.pdf?src-supplier=Digi-Key; ComponentLink3URL: https://datasheet.ciiva.com/15784/ox-oy-series-15784253.pdf?src-supplier=Onlinecomponents.com; ComponentLink3Description: https://datasheet.ciiva.com/15784/ox-oy-series-15784253.pdf?src-supplier=Onlinecomponents.com; Supplier Part Number 1: OY472KE-ND
R23 R27 = R_33: RES 33 OHM 1/2W 5% AXIAL; Manufacturer: Stackpole Electronics; Manufacturer Part Number: CF12JT33R0; Resistance: 33R; Temperature Coefficient: -400ppm/°C; Max Power Dissipation: 500mW; Supplier 1: Digi-Key; RoHS: Yes; Category: Through-Hole Resistors; Stock 1: 54416; Pricing 1: 1=0.10000, 10=0.06500, 25=0.04720, 50=0.03600, 100=0.02660, 250=0.02024, 500=0.01620, 1000=0.01192 (USD); Mount: Through Hole,Axial; Case/Package: Conformal; Contact Plating: Tin,Matte; Min Operating Temperature: -55°C; Max Operating Temperature: 155°C; Tolerance: 5%; Packaging: Tape and Reel; Package Quantity: 1; Resistor Type: Carbon Film; Number of Terminations: 2; Termination: Axial; Features: Flame Retardant Coating; Series: CF; Construction: Cylindrical; Diameter: 2.7mm; Length: 8.5mm; Radiation Hardening: No; Military Standard: Not; RoHS Compliant: Yes; ComponentLink1URL: http://components.arrow.com/part/dataview/53393118S46102N1174?src-supplier=Arrow+Electronics; ComponentLink1Description: http://components.arrow.com/part/dataview/53393118S46102N1174?src-supplier=Arrow+Electronics; ComponentLink2URL: https://www.seielect.com/Catalog/SEI-CF_CFM.pdf?src-supplier=Digi-Key; ComponentLink2Description: https://www.seielect.com/Catalog/SEI-CF_CFM.pdf?src-supplier=Digi-Key; ComponentLink3URL: https://www.seielect.com/catalog/SEI-CF_CFM.pdf?src-supplier=Avnet; ComponentLink3Description: https://www.seielect.com/catalog/SEI-CF_CFM.pdf?src-supplier=Avnet; Supplier Part Number 1: CF12JT33R0CT-ND
ZD1 ZD2 = ZD_15V_1W: GLOVE, POLYAMIDE, L/FREE, PU, SIZE 6 - More Details; Manufacturer: NXP Semiconductors; Manufacturer Part Number: BZV85-C15,113; Tolerance: 5%; Forward Voltage: 1V; Max Power Dissipation: 1.3W; Max Reverse Leakage Current: 50nA; Impedance: 15R; Zener Voltage: 14.7V; Working Voltage: 15V; Test Current: 15mA; Collector Emitter Breakdown Voltage: -65V; Polarity: PNP; Transition Frequency: 100MHz; Element Configuration: Single; ESD Protection: No; Supplier 1: Digi-Key; RoHS: Yes; Category: Zener Diodes; Stock 1: 3969; Pricing 1: 1=0.27000, 10=0.22500, 100=0.11910, 500=0.07838, 1000=0.05330, 2000=0.04807 (USD); Mount: Through Hole; Case/Package: DO-41; Number of Pins: 2; Weight: 0.01lb; Contact Plating: Tin; Min Operating Temperature: -65°C; Max Operating Temperature: 200°C; Packaging: Tape and Reel; Package Quantity: 5000; Power Dissipation: 1.3W; Voltage Tolerance: 5%; Max Reverse Current: 50nA; Length: 4.8mm; Width: 2.6mm; Height: 2.6mm; Radiation Hardening: No; REACH SVHC: No SVHC; Lead Free: Lead Free; RoHS Compliant: Yes; ComponentLink1URL: https://datasheet.ciiva.com/891/bzv85-ser-891077.pdf?src-supplier=Digi-Key; ComponentLink1Description: https://datasheet.ciiva.com/891/bzv85-ser-891077.pdf?src-supplier=Digi-Key; ComponentLink2URL: https://datasheet.ciiva.com/8346/bzv85-ser-8346890.pdf?src-supplier=Avnet; ComponentLink2Description: https://datasheet.ciiva.com/8346/bzv85-ser-8346890.pdf?src-supplier=Avnet; ComponentLink3URL: https://datasheet.ciiva.com/16389/bzv85-16389479.pdf?src-supplier=Future+Electronics; ComponentLink3Description: https://datasheet.ciiva.com/16389/bzv85-16389479.pdf?src-supplier=Future+Electronics; ComponentLink4URL: https://datasheet.ciiva.com/17264/bzv85-ser-17264095.pdf?src-supplier=Avnet+Europe; ComponentLink4Description: https://datasheet.ciiva.com/17264/bzv85-ser-17264095.pdf?src-supplier=Avnet+Europe; ComponentLink5URL: https://datasheet.ciiva.com/8346/bzv85-ser-8346895.pdf?src-supplier=Avnet; ComponentLink5Description: https://datasheet.ciiva.com/8346/bzv85-ser-8346895.pdf?src-supplier=Avnet; ComponentLink6URL: https://datasheet.ciiva.com/16474/bzv85-ser-16474057.pdf?src-supplier=Avnet+Asia; ComponentLink6Description: https://datasheet.ciiva.com/16474/bzv85-ser-16474057.pdf?src-supplier=Avnet+Asia; ComponentLink7URL: https://datasheet.ciiva.com/46392/812952-46392438.pdf?src-supplier=Element14; ComponentLink7Description: https://datasheet.ciiva.com/46392/812952-46392438.pdf?src-supplier=Element14; Supplier Part Number 1: 1727-4979-1-ND